# Altium schematic sheet start.SchDoc
size A4
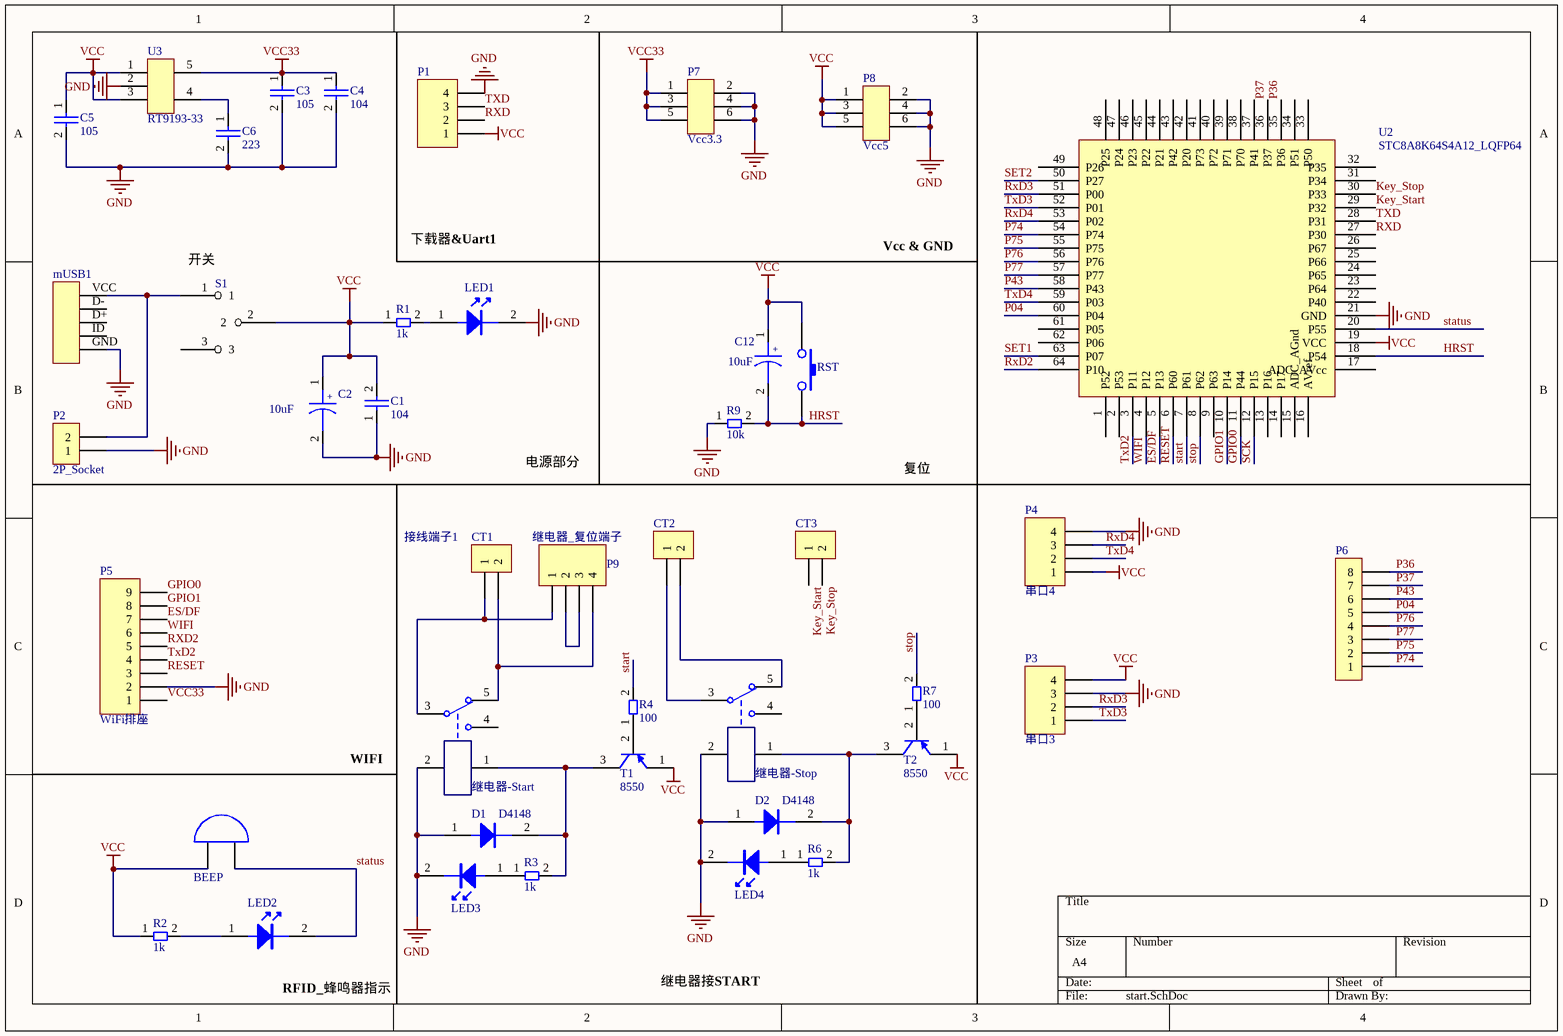
[diagram p0: start.SchDoc]

## Parts
BEEP2  BEEP  [BEEP]
C1  104  [CAP]
C2  10uF  [capc]
C3  105  [CAP]
C4  104  [CAP]
C5  105  [CAP]
C6  223  [CAP]
C12  10uF  [capc]
CT1  ConTerminal  [ConTerminal]  (value not drawn)
CT2  ConTerminal  [ConTerminal]  (value not drawn)
CT3  ConTerminal  [ConTerminal]  (value not drawn)
D1  D4148  [D4148_1206]
D2  D4148  [D4148_1206]
LED1  LED_3mm  [LED_3mm]  (value not drawn)
LED2  LED_3mm  [LED_3mm]  (value not drawn)
LED3  LED_3mm  [LED_3mm]  (value not drawn)
LED4  LED_3mm  [LED_3mm]  (value not drawn)
mUSB1  mUSB  [mUSB]  (value not drawn)
P1  pin4  [pin4]  (value not drawn)
P2  2P_Socket  [2P_Socket]
P3  串口3  [4P_Socket]
P4  串口4  [4P_Socket]
P5  WiFi排座  [WiFi]
P6  pin8  [pin8]  (value not drawn)
P7  Vcc3.3  [pin6]
P8  Vcc5  [pin6]
P9  继电器_复位端子  [4P_Socket]
R1  1k  [res]
R2  1k  [res]
R3  1k  [res]
R4  100  [res]
R6  1k  [res]
R7  100  [res]
R9  10k  [res]
Relay2  继电器-Stop  [继电器-SRD]
Rely1  继电器-Start  [继电器-SRD]
RST  SW_PB  [SW_PB]  (value not drawn)
S1  Horizontal_Switch  [Horizontal_Switch]  (value not drawn)
T1  8550  [PNP]
T2  8550  [PNP]
U2  STC8A8K64S4A12_LQFP64  [STC8A8K64S4A12_LQFP64S]
U3  RT9193-33  [RT9193-33]

## Nets
GND: C1.1 C2.2 C3.2 C4.2 C5.2 C6.2 D1.1 D2.1 LED1.2 LED3.2 LED4.2 mUSB1.GND P1.4 P2.1 P3.3 P4.4 P5.2 P7.2 P7.4 P7.6 P8.2 P8.4 P8.6 R9.1 Relay2.2 Rely1.2 U2.21(GND) U3.2(GND)
VCC: BEEP2.1 C1.2 C2.1 C5.1 C12.1 P1.1 P3.4 P4.1 P8.1 P8.3 P8.5 R1.1 R2.1 RST.1 S1.2 T1.1(E) T2.1(E) U2.19(VCC) U3.1(VIN) U3.3(EN)
VCC33: C3.1 C4.1 P5.1 P7.1 P7.3 P7.5 U3.5(VOUT)
ES/DF: P5.7 U2.5(P13)
GPIO0: P5.9 U2.11(P44)
GPIO1: P5.8 U2.10(P14)
HRST: C12.2 R9.2 RST.2 U2.18(P54)
Key_Start: CT3.1 U2.29(P32)
Key_Stop: CT3.2 U2.30(P33)
P04: P6.5 U2.60(P04)
P36: P6.8 U2.35(P36)
P37: P6.7 U2.36(P37)
P43: P6.6 U2.58(P43)
P74: P6.1 U2.54(P74)
P75: P6.2 U2.55(P75)
P76: P6.4 U2.56(P76)
P77: P6.3 U2.57(P77)
RESET: P5.3 U2.6(P60)
RXD: P1.2 U2.27(P30)
RxD2: P5.5 U2.64(P10)
RxD3: P3.2 U2.51(P00)
RxD4: P4.3 U2.53(P02)
SCK: U2.12(P15)
SET1: U2.63(P07)
SET2: U2.50(P27)
start: R4.2 U2.7(P61)
status: BEEP2.2 LED2.2 U2.20(P55)
stop: R7.2 U2.8(P62)
TXD: P1.3 U2.28(P31)
TxD2: P5.4 U2.3(P11)
TxD3: P3.1 U2.52(P01)
TxD4: P4.2 U2.59(P03)
WIFI: P5.6 U2.4(P12)
NetC6_1: C6.1 U3.4(BP)
NetCT1_1: CT1.1 P9.1 Rely1.3
NetCT1_2: CT1.2 P9.4 Rely1.5
NetCT2_1: CT2.1 Relay2.3
NetCT2_2: CT2.2 Relay2.5
NetD1_2: D1.2 R3.2 Rely1.1 T1.3(C)
NetD2_2: D2.2 R6.2 Relay2.1 T2.3(C)
NetLED1_1: LED1.1 R1.2
NetLED2_1: LED2.1 R2.2
NetLED3_1: LED3.1 R3.1
NetLED4_1: LED4.1 R6.1
NetmUSB1_VCC: mUSB1.VCC P2.2 S1.1
NetP9_2: P9.2 P9.3
NetR4_1: R4.1 T1.2(B)
NetR7_1: R7.1 T2.2(B)

Not connected (* = marked no-connect by the designer): mUSB1 D+ D- ID; Relay2 4; Rely1 4; S1 3; U2 1(P52) 2(P53) 9(P63) 13(P16) 14(P17) 15(ADC_AGnd) 16(AVref) 17(ADC_AVcc) 22(P40) 23(P64) 24(P65) 25(P66) 26(P67) 31(P34) 32(P35) 33(P50) 34(P51) 37(P41) 38(P70) 39(P71) 40(P72) 41(P73) 42(P20) 43(P42) 44(P21) 45(P22) 46(P23) 47(P24) 48(P25) 49(P26) 61(P05) 62(P06)

## Notes on the sheet
- 下载器&Uart1
- Vcc & GND
- (near S1) 开关
- 电源部分
- 复位
- 接线端子1
- WIFI
- 继电器接START
- (near LED2) RFID_蜂鸣器指示
- (in symbol CAPC) +

## Library data of the parts
C1 C3-C6 = CAP
C2 C12 = CAPC
D1 D2 = D4148_1206
P3 P4 P9 = 4P_Socket
P5 = WiFi
P7 P8 = pin6
R1-R4 R6 R7 R9 = RES
Relay2 Rely1 = 继电器-SRD
T1 T2 = PNP